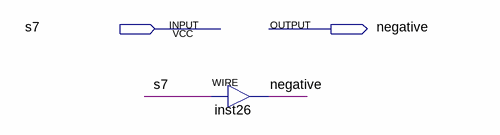
[diagram p0: schematic sheet]
// Quartus schematic negative_check.bdf as structural Verilog: 1 symbols, 2 pins
module negative_check (
  input  s7,
  output negative
);

  assign negative = s7;  // WIRE inst26
endmodule
